# Altium project BTB40Pin2AWG28.PrjPcb
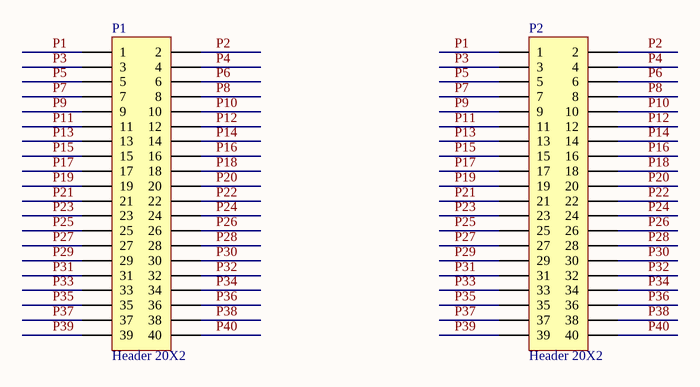
[diagram p0: Sheet2.SchDoc]
1 sheet, 2 parts. Net scope: global (net labels, ports and power ports of the same name join across sheets).
Board file: PCB3.PcbDoc

## Sheet Sheet2.SchDoc
size A4

### Parts
P1  Header 20X2  [P40Con2mm]
P2  Header 20X2  [BTB0.8con40Pin]

### Nets
P1: P1.1 P2.1
P2: P1.2 P2.2
P3: P1.3 P2.3
P4: P1.4 P2.4
P5: P1.5 P2.5
P6: P1.6 P2.6
P7: P1.7 P2.7
P8: P1.8 P2.8
P9: P1.9 P2.9
P10: P1.10 P2.10
P11: P1.11 P2.11
P12: P1.12 P2.12
P13: P1.13 P2.13
P14: P1.14 P2.14
P15: P1.15 P2.15
P16: P1.16 P2.16
P17: P1.17 P2.17
P18: P1.18 P2.18
P19: P1.19 P2.19
P20: P1.20 P2.20
P21: P1.21 P2.21
P22: P1.22 P2.22
P23: P1.23 P2.23
P24: P1.24 P2.24
P25: P1.25 P2.25
P26: P1.26 P2.26
P27: P1.27 P2.27
P28: P1.28 P2.28
P29: P1.29 P2.29
P30: P1.30 P2.30
P31: P1.31 P2.31
P32: P1.32 P2.32
P33: P1.33 P2.33
P34: P1.34 P2.34
P35: P1.35 P2.35
P36: P1.36 P2.36
P37: P1.37 P2.37
P38: P1.38 P2.38
P39: P1.39 P2.39
P40: P1.40 P2.40

### Library data of the parts
P1 P2 = Header 20X2: Header, 20-Pin, Dual row; LatestRevisionDate: 17-Jul-2002; LatestRevisionNote: Re-released for DXP Platform.; Publisher: Altium Limited